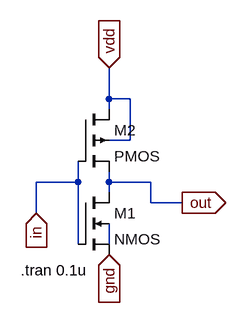
[diagram p0: schematic inv.asc]
inv.asc, the LTspice schematic file:
Version 4.1
SHEET 1 880 680
WIRE 256 0 256 -48
WIRE 288 0 256 0
WIRE 256 16 256 0
WIRE 288 64 288 0
WIRE 288 64 256 64
WIRE 208 128 208 96
WIRE 208 128 144 128
WIRE 256 128 256 112
WIRE 320 128 256 128
WIRE 256 144 256 128
WIRE 320 160 320 128
WIRE 368 160 320 160
WIRE 144 176 144 128
WIRE 208 224 208 128
WIRE 256 224 256 192
FLAG 256 -48 vdd
IOPIN 256 -48 In
FLAG 144 176 in
IOPIN 144 176 In
FLAG 368 160 out
IOPIN 368 160 Out
FLAG 256 240 gnd
IOPIN 256 240 In
SYMBOL nmos4 208 144 R0
SYMATTR InstName M1
SYMBOL pmos4 208 16 R0
SYMATTR InstName M2
TEXT 120 264 Left 2 !.tran 0.1u

The netlist it stands for:
* inv.asc
M1 out in gnd N001 NMOS
M2 vdd in out vdd PMOS
.model NMOS NMOS
.model PMOS PMOS
.lib standard.mos
.tran 0.1u
.backanno
.end